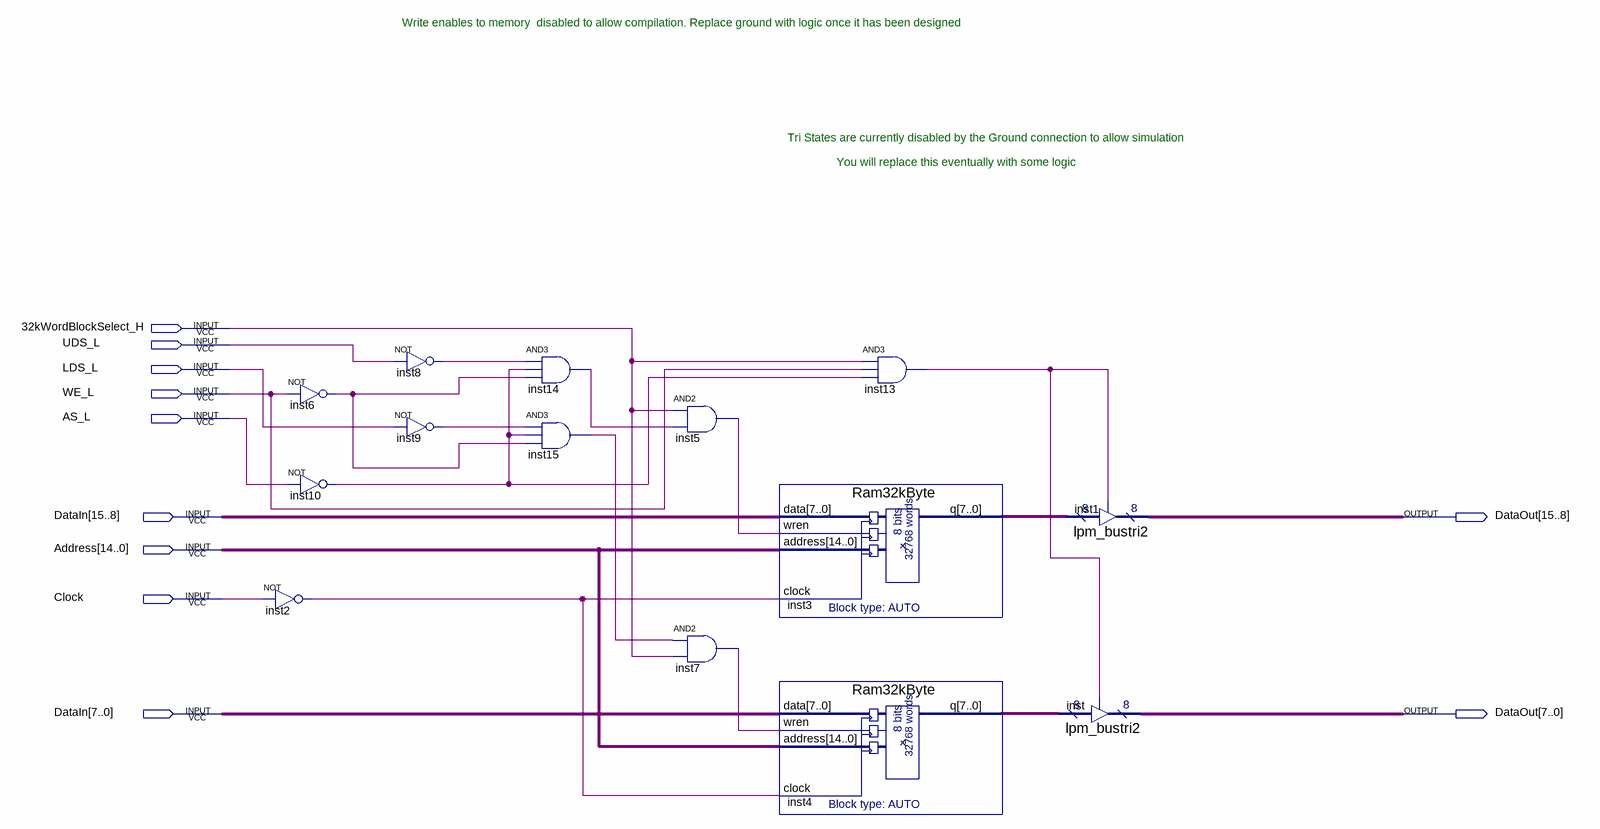
[diagram p0: schematic sheet]
// Quartus schematic SramBlock_32KWord.bdf as structural Verilog: 14 symbols, 11 pins
module SramBlock_32KWord (
  input  \32kWordBlockSelect_H ,
  input  UDS_L,
  input  LDS_L,
  input  WE_L,
  input  AS_L,
  input  [15:0] DataIn,
  input  [14:0] Address,
  input  Clock,
  output [15:0] DataOut
);

  wire inst2_out, inst5_out, inst6_out, inst7_out, inst8_out, inst9_out, inst10_out, inst13_out, inst14_out,
       inst15_out;
  wire [7:0] inst3_q, inst4_q;

  not inst2 (inst2_out, Clock);
  not inst6 (inst6_out, WE_L);
  not inst10 (inst10_out, AS_L);
  not inst8 (inst8_out, UDS_L);
  not inst9 (inst9_out, LDS_L);
  and inst14 (inst14_out, inst8_out, inst10_out, inst6_out);
  and inst15 (inst15_out, inst9_out, inst10_out, inst6_out);
  and inst5 (inst5_out, \32kWordBlockSelect_H , inst14_out);
  and inst7 (inst7_out, inst15_out, \32kWordBlockSelect_H );
  Ram32kByte inst3 (.data(DataIn[15:8]), .wren(inst5_out), .address(Address), .clock(inst2_out), .q(inst3_q));
  Ram32kByte inst4 (.data(DataIn[7:0]), .wren(inst7_out), .address(Address), .clock(inst2_out), .q(inst4_q));
  and inst13 (inst13_out, \32kWordBlockSelect_H , WE_L, inst10_out);
  lpm_bustri2 inst1 (.enabledt(inst13_out), .data(inst3_q), .tridata(DataOut[15:8]));
  lpm_bustri2 inst (.enabledt(inst13_out), .data(inst4_q), .tridata(DataOut[7:0]));

  // Notes on the sheet:
  //   Write enables to memory  disabled to allow compilation. Replace ground with logic once it has been designed
  //   Tri States are currently disabled by the Ground connection to allow simulation
  //   You will replace this eventually with some logic
endmodule
